# EAGLE schematic ACC (EAGLE 9.6.2)
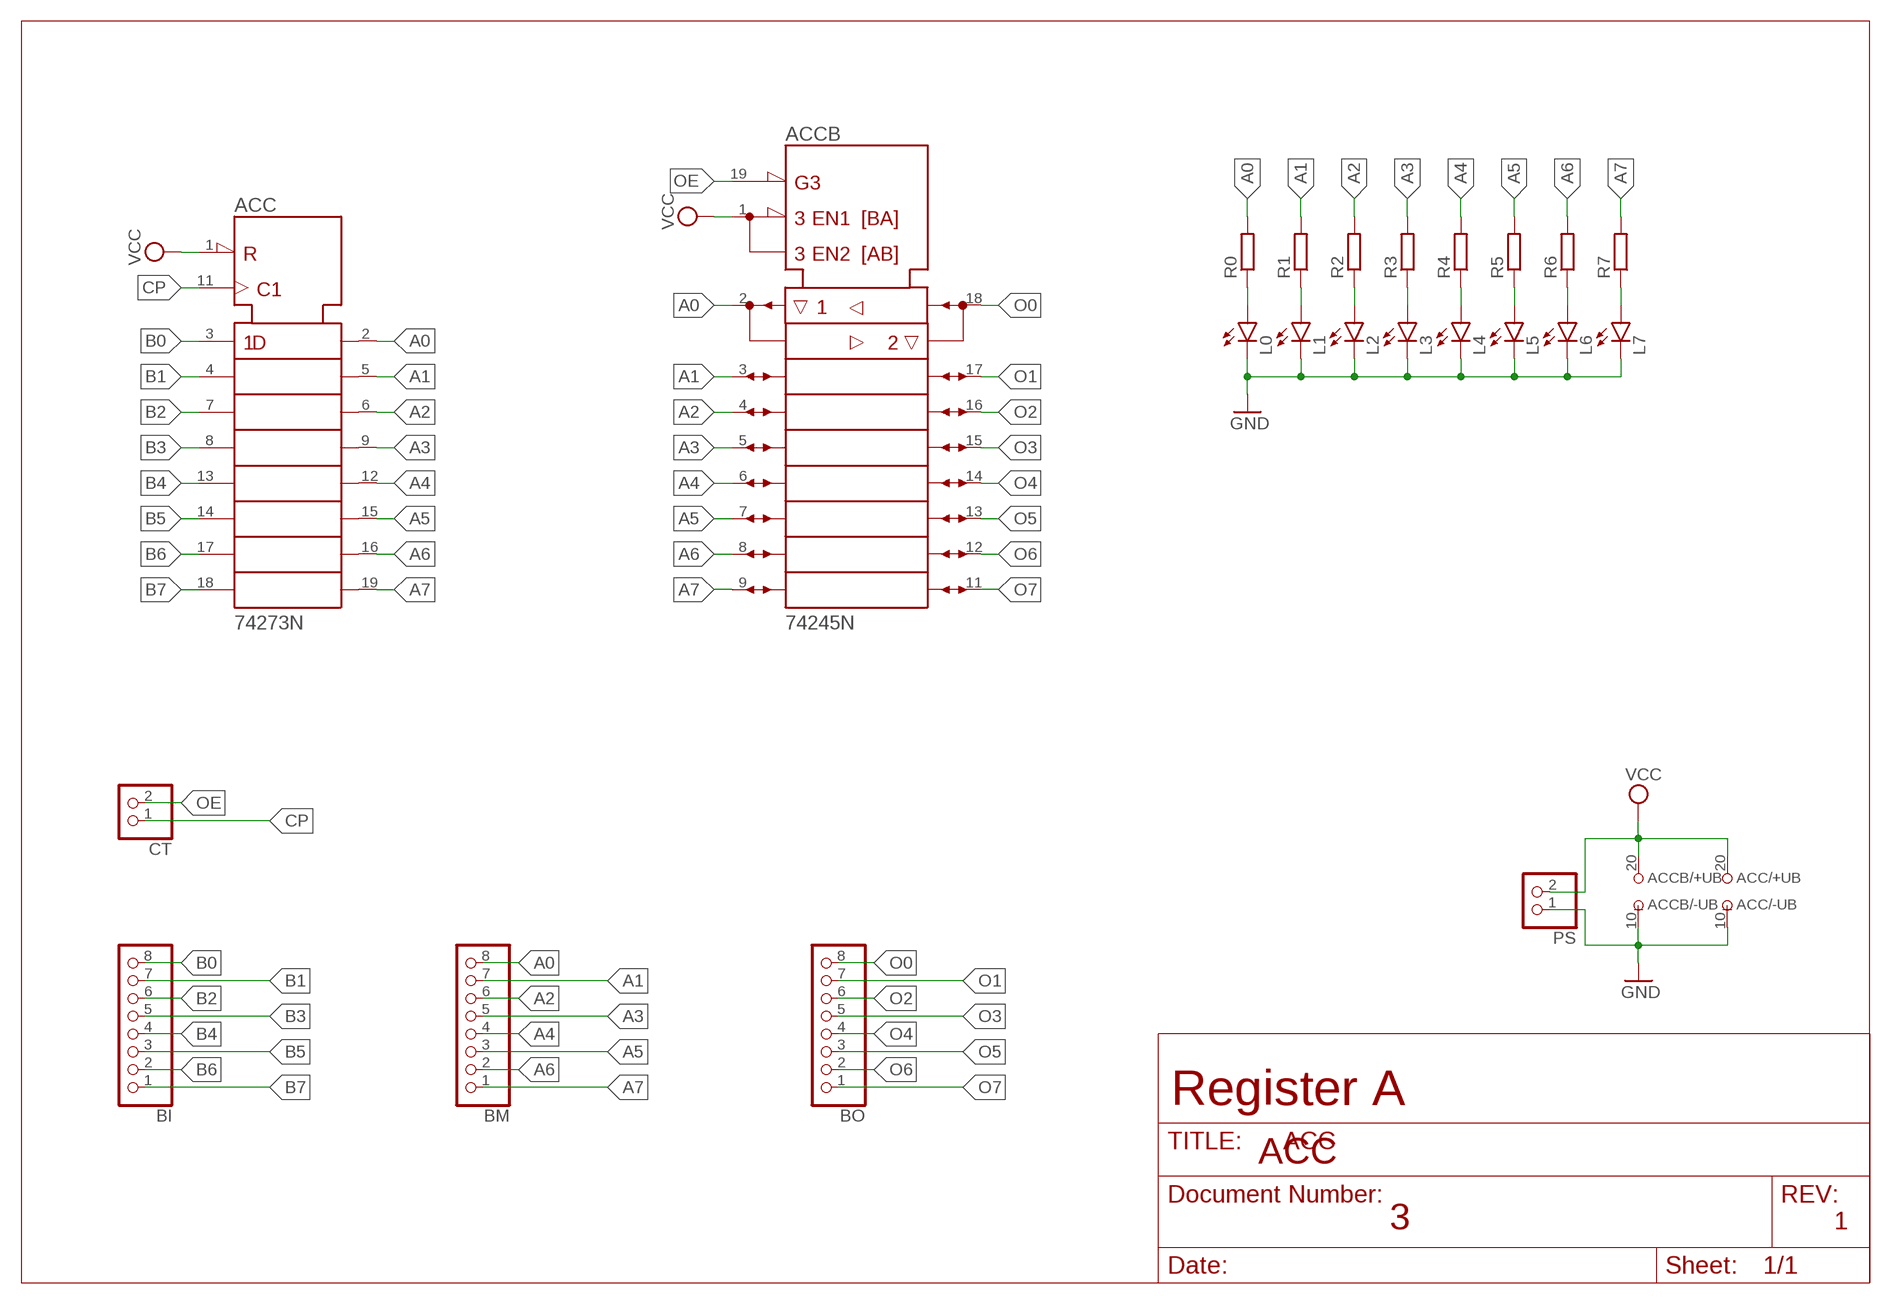
[diagram p0: schematic, sheet 1]

## Parts
ACC  74273N  [DIL20]
ACCB  74245N  [DIL20]
BI  PINHD-1X8  [1X08]
BM  PINHD-1X8  [1X08]
BO  PINHD-1X8  [1X08]
CT  PINHD-1X2  [1X02]
L0  LED5MM  [LED5MM]
L1  LED5MM  [LED5MM]
L2  LED5MM  [LED5MM]
L3  LED5MM  [LED5MM]
L4  LED5MM  [LED5MM]
L5  LED5MM  [LED5MM]
L6  LED5MM  [LED5MM]
L7  LED5MM  [LED5MM]
PS  PINHD-1X2  [1X02]
R0  R-EU_0204/7  [0204/7]
R1  R-EU_0204/7  [0204/7]
R2  R-EU_0204/7  [0204/7]
R3  R-EU_0204/7  [0204/7]
R4  R-EU_0204/7  [0204/7]
R5  R-EU_0204/7  [0204/7]
R6  R-EU_0204/7  [0204/7]
R7  R-EU_0204/7  [0204/7]

## Nets
A0: ACC.2(1Q) ACCB.2(A1) BM.8 R0.2
A1: ACC.5(2Q) ACCB.3(A2) BM.7 R1.2
A2: ACC.6(3Q) ACCB.4(A3) BM.6 R2.2
A3: ACC.9(4Q) ACCB.5(A4) BM.5 R3.2
A4: ACC.12(5Q) ACCB.6(A5) BM.4 R4.2
A5: ACC.15(6Q) ACCB.7(A6) BM.3 R5.2
A6: ACC.16(7Q) ACCB.8(A7) BM.2 R6.2
A7: ACC.19(8Q) ACCB.9(A8) BM.1 R7.2
B0: ACC.3(1D) BI.8
B1: ACC.4(2D) BI.7
B2: ACC.7(3D) BI.6
B3: ACC.8(4D) BI.5
B4: ACC.13(5D) BI.4
B5: ACC.14(6D) BI.3
B6: ACC.17(7D) BI.2
B7: ACC.18(8D) BI.1
CP: ACC.11(CLK) CT.1
GND: ACC.10(-UB) ACCB.10(-UB) L0.K(C) L1.K(C) L2.K(C) L3.K(C) L4.K(C) L5.K(C) L6.K(C) L7.K(C) PS.1
N$1: L0.A R0.1
N$4: L1.A R1.1
N$7: L2.A R2.1
N$26: L3.A R3.1
N$29: L4.A R4.1
N$32: L5.A R5.1
N$35: L6.A R6.1
N$38: L7.A R7.1
O0: ACCB.18(B1) BO.8
O1: ACCB.17(B2) BO.7
O2: ACCB.16(B3) BO.6
O3: ACCB.15(B4) BO.5
O4: ACCB.14(B5) BO.4
O5: ACCB.13(B6) BO.3
O6: ACCB.12(B7) BO.2
O7: ACCB.11(B8) BO.1
OE: ACCB.19(!G) CT.2
VCC: ACC.1(!CLR) ACC.20(+UB) ACCB.1(DIR) ACCB.20(+UB) PS.2

## Notes on the sheet
- Register A
- ACC
- 3 | 1

## Library data of the parts
ACC = 74ttl-din:74*273: Octal D type FLIP FLOP, clear
ACCB = 74ttl-din:74*245: Octal BUS TRANSCEIVER, 3-state
BI BM BO = pinhead:PINHD-1X8: PIN HEADER
CT PS = pinhead:PINHD-1X2: PIN HEADER
L0 L1-L7 = led:LED: LED OSRAM: - CHIPLED LG R971, LG N971, LY N971, LG Q971, LY Q971, LO R971, LY R971 LH N974, LH R974 LS Q976, LO Q976, LY Q976 LO Q996 - Hyper CHIPLED LW Q18S LB Q993, LB Q99A, LB R99A - SideLED LS A670, LO A670, LY A670, LG A670, LP A670 LB A673, LV A673, LT A673, LW A673 LH A674 LY A675 LS A676, LA A676, LO A676, LY A676, LW A676 LS A679, LY A679, LG A679 - Hyper Micro SIDELED® LS Y876, LA Y876, LO Y876, LY Y876 LT Y87S - SmartLED LW L88C, LW L88S LB L89C, LB L89S, LG L890 LS L89K, LO L89K, LY L89K LS L896, LA L896, LO L896, LY L896 - TOPLED LS T670, LO T670, LY T670, LG T670, LP T670 LSG T670, LSP T670, LSY T670, LOP T670, LYG T670 LG T671, LOG T671, LSG T671 LB T673, LV T673, LT T673, LW T673 LH T674 LS T676, LA T676, LO T676, LY T676, LB T676, LH T676, LSB T676, LW T676 LB T67C, LV T67C, LT T67C, LS T67K, LO T67K, LY T67K, LW E67C LS E67B, LA E67B, LO E67B, LY E67B, LB E67C, LV E67C, LT E67C LW T67C LS T679, LY T679, LG T679 LS T770, LO T770, LY T770, LG T770, LP T770 LB T773, LV T773, LT T773, LW T773 LH T774 LS E675, LA E675, LY E675, LS T675 LS T776, LA T776, LO T776, LY T776, LB T776 LHGB T686 LT T68C, LB T68C - Hyper Mini TOPLED® LB M676 - Mini TOPLED Santana® LG M470 LS M47K, LO M47K, LY M47K Source: http://www.osram.convergy.de LUXEON: - LUMILED® LXK2-PW12-R00, LXK2-PW12-S00, LXK2-PW14-U00, LXK2-PW14-V00 LXK2-PM12-R00, LXK2-PM12-S00, LXK2-PM14-U00 LXK2-PE12-Q00, LXK2-PE12-R00, LXK2-PE12-S00, LXK2-PE14-T00, LXK2-PE14-U00 LXK2-PB12-K00, LXK2-PB12-L00, LXK2-PB12-M00, LXK2-PB14-N00, LXK2-PB14-P00, LXK2-PB14-Q00 LXK2-PR12-L00, LXK2-PR12-M00, LXK2-PR14-Q00, LXK2-PR14-R00 LXK2-PD12-Q00, LXK2-PD12-R00, LXK2-PD12-S00 LXK2-PH12-R00, LXK2-PH12-S00 LXK2-PL12-P00, LXK2-PL12-Q00, LXK2-PL12-R00 Source: www.luxeon.com KINGBRIGHT: KA-3528ASYC Source: www.kingbright.com
R0 R1-R7 = rcl:R-EU_: RESISTOR, European symbol; SPICEPREFIX: R